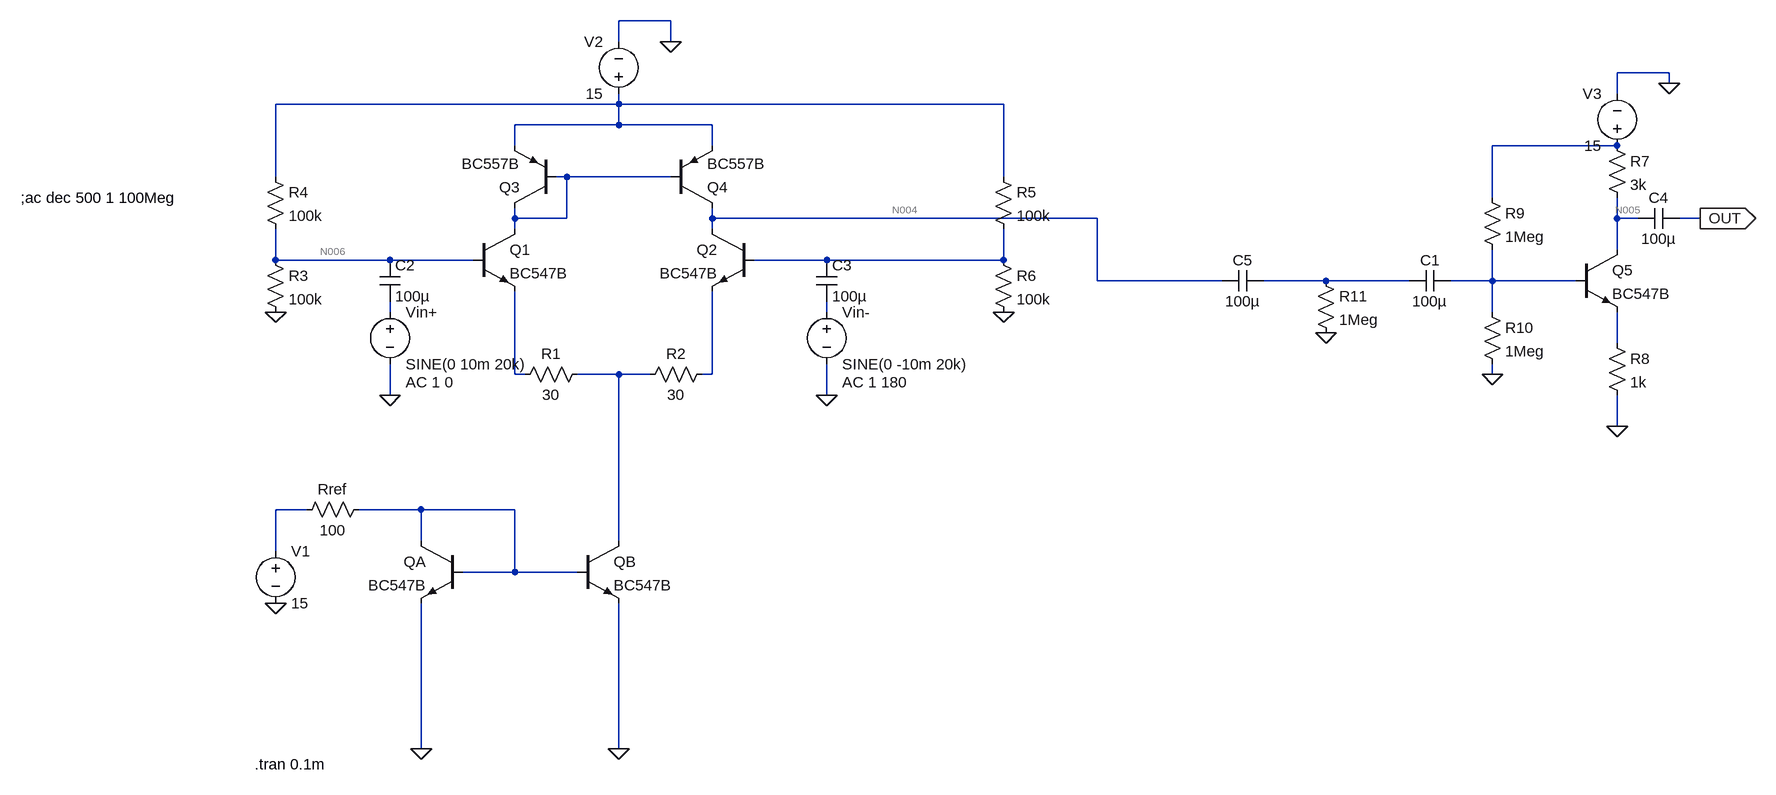
[diagram p0: schematic BJT_Diff_amp_Gain_DE.asc]
BJT_Diff_amp_Gain_DE.asc, the LTspice schematic file:
Version 4
SHEET 1 2092 1044
WIRE 240 -240 160 -240
WIRE 160 -208 160 -240
WIRE 240 -208 240 -240
WIRE 1776 -160 1696 -160
WIRE 1776 -144 1776 -160
WIRE 1696 -128 1696 -160
WIRE 160 -112 160 -128
WIRE 160 -112 -368 -112
WIRE 752 -112 160 -112
WIRE 160 -80 160 -112
WIRE 160 -80 0 -80
WIRE 304 -80 160 -80
WIRE 0 -48 0 -80
WIRE 304 -48 304 -80
WIRE 1696 -48 1504 -48
WIRE -368 0 -368 -112
WIRE 80 0 64 0
WIRE 240 0 80 0
WIRE 752 0 752 -112
WIRE 1504 32 1504 -48
WIRE 0 64 0 48
WIRE 80 64 80 0
WIRE 80 64 0 64
WIRE 304 64 304 48
WIRE 896 64 304 64
WIRE 1696 64 1696 32
WIRE 1728 64 1696 64
WIRE 1824 64 1792 64
WIRE 0 80 0 64
WIRE 304 80 304 64
WIRE 1696 112 1696 64
WIRE -368 128 -368 80
WIRE -192 128 -368 128
WIRE -64 128 -192 128
WIRE 480 128 368 128
WIRE 752 128 752 80
WIRE 752 128 480 128
WIRE 896 160 896 64
WIRE 1088 160 896 160
WIRE 1248 160 1152 160
WIRE 1376 160 1248 160
WIRE 1504 160 1504 112
WIRE 1504 160 1440 160
WIRE 1632 160 1504 160
WIRE -192 208 -192 192
WIRE 480 208 480 192
WIRE 1504 208 1504 160
WIRE 1696 256 1696 208
WIRE 0 304 0 176
WIRE 16 304 0 304
WIRE 160 304 96 304
WIRE 208 304 160 304
WIRE 304 304 304 176
WIRE 304 304 288 304
WIRE 1504 304 1504 288
WIRE -192 336 -192 288
WIRE 480 336 480 288
WIRE 1696 384 1696 336
WIRE -320 512 -368 512
WIRE -144 512 -240 512
WIRE 0 512 -144 512
WIRE -144 560 -144 512
WIRE 160 560 160 304
WIRE -368 576 -368 512
WIRE 0 608 0 512
WIRE 0 608 -80 608
WIRE 96 608 0 608
WIRE -144 880 -144 656
WIRE 160 880 160 656
FLAG -192 336 0
FLAG 480 336 0
FLAG 240 -208 0
FLAG -144 880 0
FLAG 160 880 0
FLAG -368 656 0
FLAG -368 208 0
FLAG 752 208 0
FLAG 1696 384 0
FLAG 1776 -144 0
FLAG 1824 64 OUT
IOPIN 1824 64 Out
FLAG 1504 304 0
FLAG 1248 240 0
SYMBOL npn 368 80 M0
SYMATTR InstName Q2
SYMATTR Value BC547B
SYMBOL npn -64 80 R0
SYMATTR InstName Q1
SYMATTR Value BC547B
SYMBOL res 112 288 R90
WINDOW 0 0 56 VBottom 2
WINDOW 3 32 56 VTop 2
SYMATTR InstName R1
SYMATTR Value 30
SYMBOL res 304 288 R90
WINDOW 0 0 56 VBottom 2
WINDOW 3 32 56 VTop 2
SYMATTR InstName R2
SYMATTR Value 30
SYMBOL npn 96 560 R0
SYMATTR InstName QB
SYMATTR Value BC547B
SYMBOL npn -80 560 M0
SYMATTR InstName QA
SYMATTR Value BC547B
SYMBOL res -224 496 R90
WINDOW 0 0 56 VBottom 2
WINDOW 3 32 56 VTop 2
SYMATTR InstName Rref
SYMATTR Value 100
SYMBOL voltage 160 -112 R180
WINDOW 0 24 96 Left 2
WINDOW 3 24 16 Left 2
WINDOW 123 0 0 Left 0
WINDOW 39 0 0 Left 0
SYMATTR InstName V2
SYMATTR Value 15
SYMBOL voltage -192 192 R0
WINDOW 123 24 124 Left 2
WINDOW 39 0 0 Left 0
SYMATTR Value2 AC 1 0
SYMATTR InstName Vin+
SYMATTR Value SINE(0 10m 20k)
SYMBOL voltage 480 192 R0
WINDOW 123 24 124 Left 2
WINDOW 39 0 0 Left 0
SYMATTR Value2 AC 1 180
SYMATTR InstName Vin-
SYMATTR Value SINE(0 -10m 20k)
SYMBOL pnp 64 48 R180
SYMATTR InstName Q3
SYMATTR Value BC557B
SYMBOL pnp 240 48 M180
SYMATTR InstName Q4
SYMATTR Value BC557B
SYMBOL voltage -368 560 R0
WINDOW 123 0 0 Left 0
WINDOW 39 0 0 Left 0
SYMATTR InstName V1
SYMATTR Value 15
SYMBOL cap -208 128 R0
SYMATTR InstName C2
SYMATTR Value 100µ
SYMBOL cap 464 128 R0
SYMATTR InstName C3
SYMATTR Value 100µ
SYMBOL res -384 112 R0
SYMATTR InstName R3
SYMATTR Value 100k
SYMBOL res -384 -16 R0
SYMATTR InstName R4
SYMATTR Value 100k
SYMBOL res 736 -16 R0
SYMATTR InstName R5
SYMATTR Value 100k
SYMBOL res 736 112 R0
SYMATTR InstName R6
SYMATTR Value 100k
SYMBOL npn 1632 112 R0
SYMATTR InstName Q5
SYMATTR Value BC547B
SYMBOL res 1680 -64 R0
SYMATTR InstName R7
SYMATTR Value 3k
SYMBOL res 1680 240 R0
SYMATTR InstName R8
SYMATTR Value 1k
SYMBOL voltage 1696 -32 R180
WINDOW 0 24 96 Left 2
WINDOW 3 24 16 Left 2
WINDOW 123 0 0 Left 0
WINDOW 39 0 0 Left 0
SYMATTR InstName V3
SYMATTR Value 15
SYMBOL cap 1792 48 R90
WINDOW 0 0 32 VBottom 2
WINDOW 3 32 32 VTop 2
SYMATTR InstName C4
SYMATTR Value 100µ
SYMBOL res 1488 16 R0
SYMATTR InstName R9
SYMATTR Value 1Meg
SYMBOL res 1488 192 R0
SYMATTR InstName R10
SYMATTR Value 1Meg
SYMBOL cap 1440 144 R90
WINDOW 0 0 32 VBottom 2
WINDOW 3 32 32 VTop 2
SYMATTR InstName C1
SYMATTR Value 100µ
SYMBOL res 1232 144 R0
SYMATTR InstName R11
SYMATTR Value 1Meg
SYMBOL cap 1152 144 R90
WINDOW 0 0 32 VBottom 2
WINDOW 3 32 32 VTop 2
SYMATTR InstName C5
SYMATTR Value 100µ
TEXT -400 904 Left 2 !.tran 0.1m
TEXT -760 32 Left 2 !;ac dec 500 1 100Meg

The netlist it stands for:
* BJT_Diff_amp_Gain_DE.asc
Q2 N004 N007 N015 0 BC547B
Q1 N003 N006 N013 0 BC547B
R1 N014 N013 30
R2 N015 N014 30
QB N014 N017 0 0 BC547B
QA N017 N017 0 0 BC547B
Rref N017 N016 100
V2 N001 0 15
Vin+ N010 0 SINE(0 10m 20k) AC 1 0
Vin- N011 0 SINE(0 -10m 20k) AC 1 180
Q3 N003 N003 N001 0 BC557B
Q4 N004 N003 N001 0 BC557B
V1 N016 0 15
C2 N006 N010 100µ
C3 N007 N011 100µ
R3 N006 0 100k
R4 N001 N006 100k
R5 N001 N007 100k
R6 N007 0 100k
Q5 N005 N009 N012 0 BC547B
R7 N002 N005 3k
R8 N012 0 1k
V3 N002 0 15
C4 OUT N005 100µ
R9 N002 N009 1Meg
R10 N009 0 1Meg
C1 N009 N008 100µ
R11 N008 0 1Meg
C5 N008 N004 100µ
.model NPN NPN
.model PNP PNP
.lib standard.bjt
.tran 0.1m
;ac dec 500 1 100Meg
.backanno
.end

* Results of the author's LTspice run, read from the files saved beside the schematic
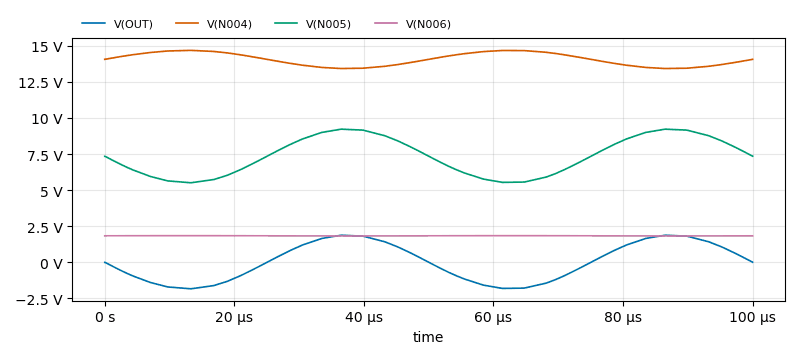
[diagram p1: Transient Analysis of BJT_Diff_amp_Gain_DE.asc, plotted from the saved traces]
* Transient Analysis, 1 run:
*   V(OUT): min -1.831 V, max 1.879 V, average 14.45 mV, rms 1.31 V, last 9.451 mV
*   V(N004): min 13.42 V, max 14.68 V, average 14.05 V, rms 14.06 V, last 14.05 V
*   V(N005): min 5.51 V, max 9.22 V, average 7.355 V, rms 7.471 V, last 7.35 V
*   V(N006): min 1.828 V, max 1.848 V, average 1.838 V, rms 1.838 V, last 1.838 V